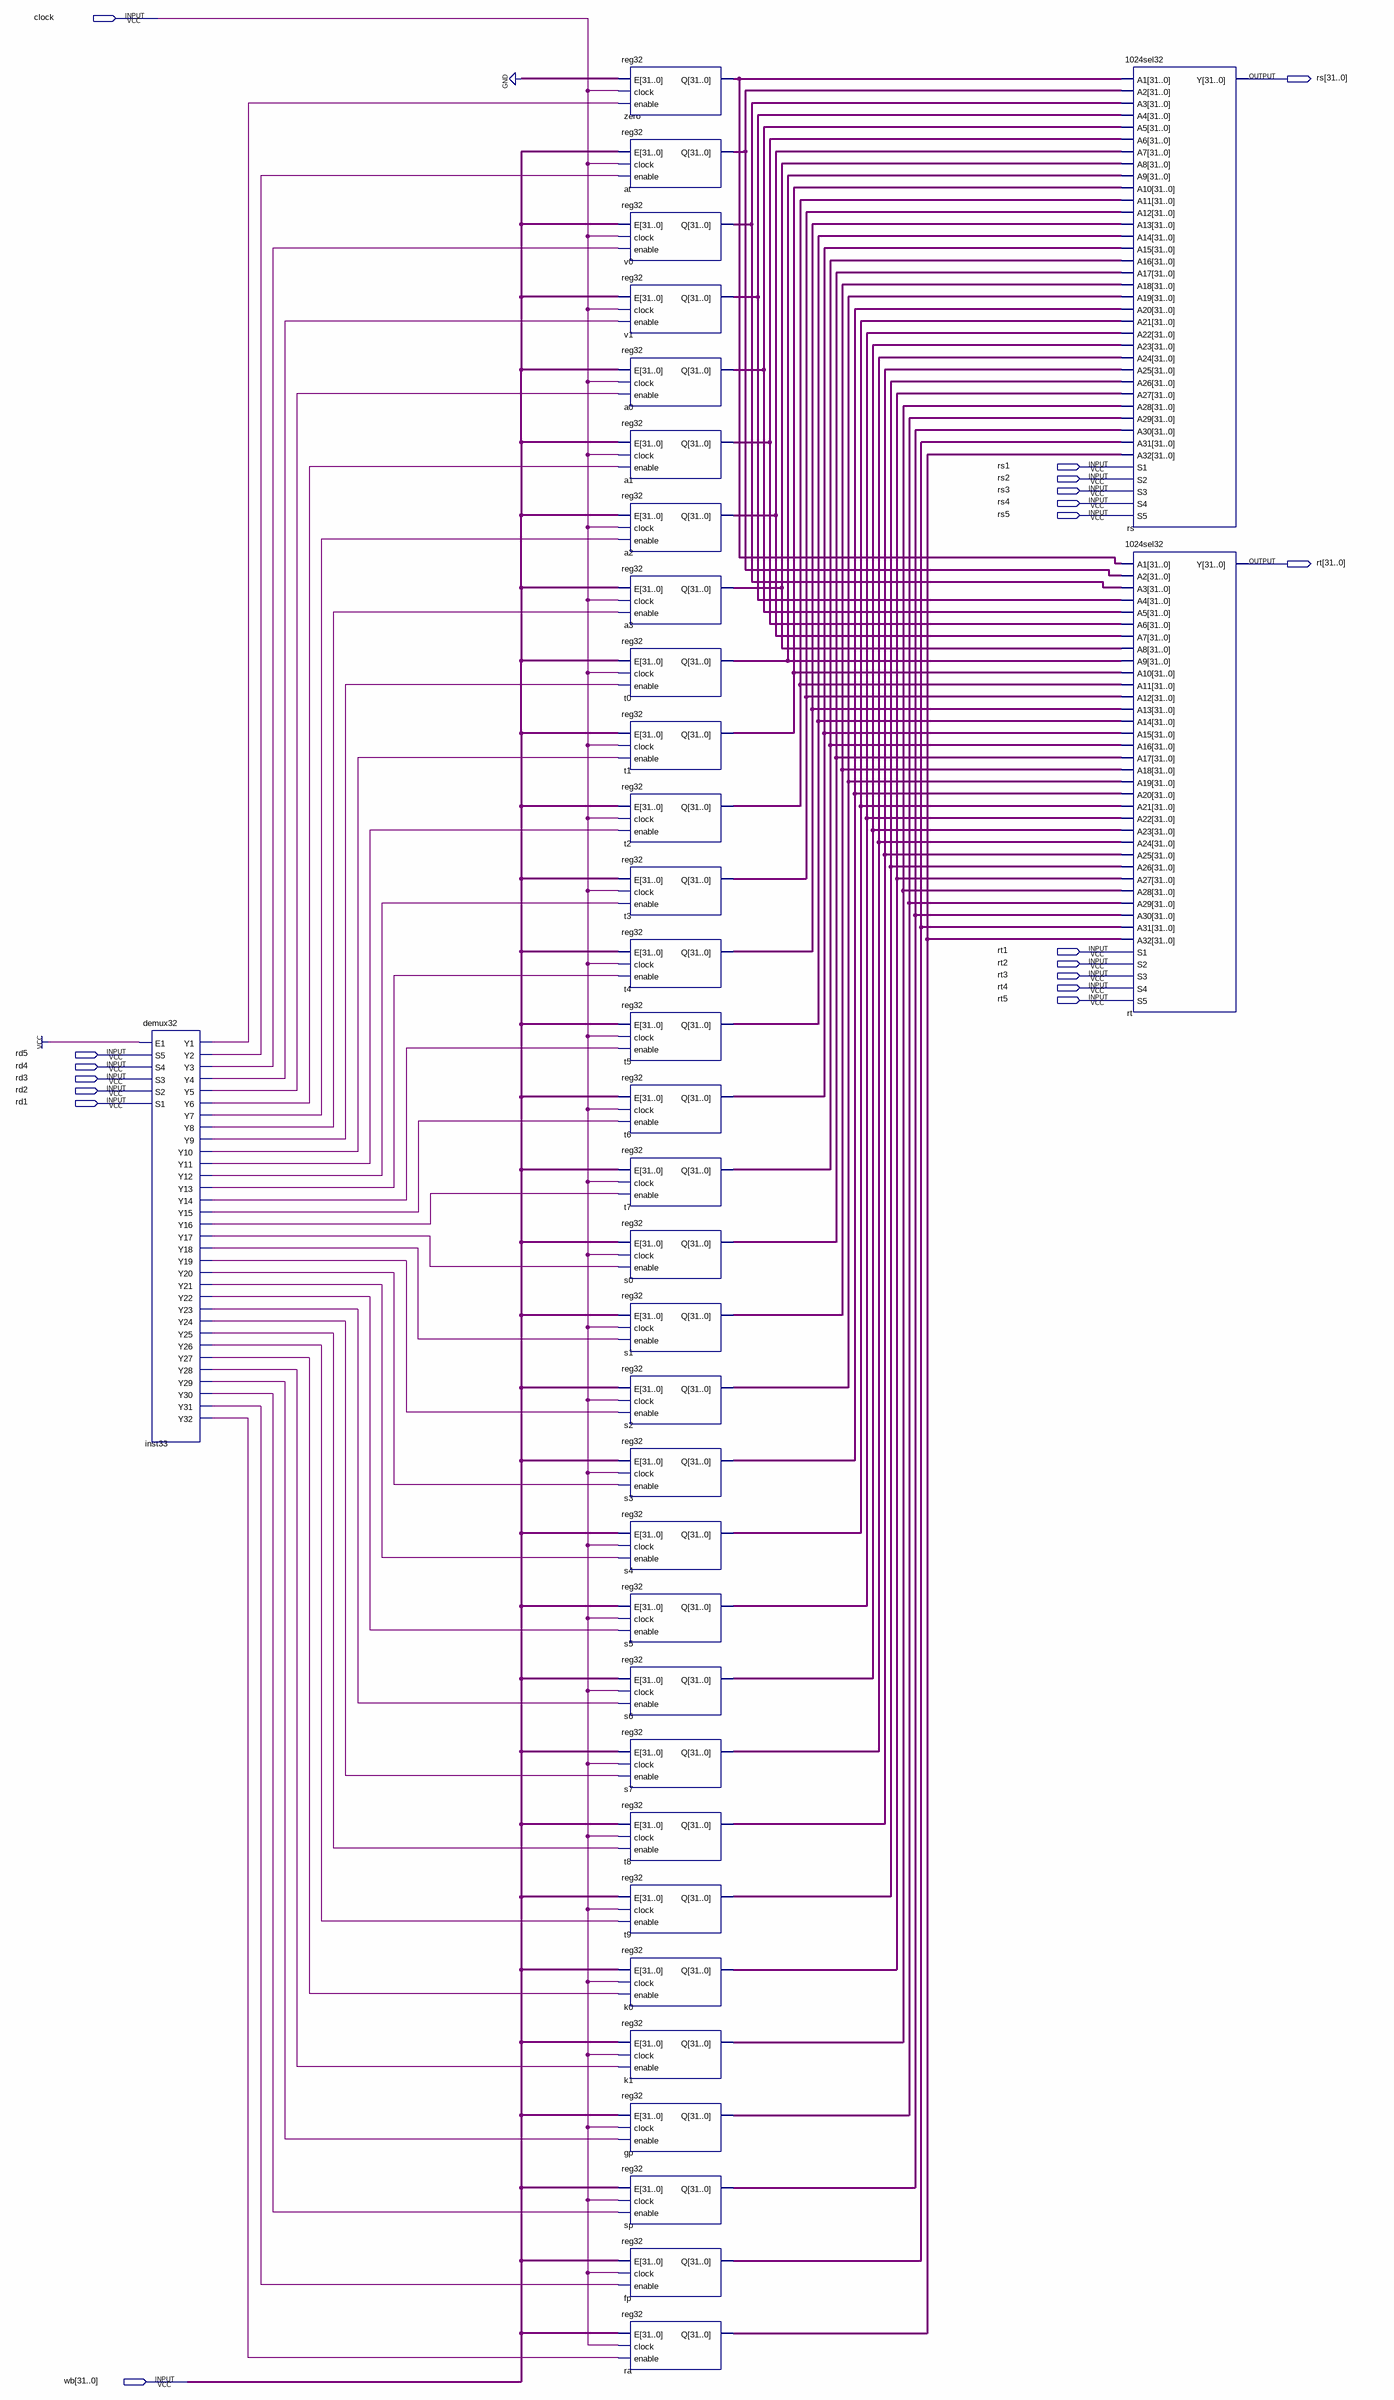
[diagram p0: schematic sheet]
// Quartus schematic reg_bank.bdf as structural Verilog: 35 symbols, 19 pins
module reg_bank (
  input  clock,
  input  rs1,
  input  rs2,
  input  rs3,
  input  rs4,
  input  rs5,
  input  rt1,
  input  rt2,
  input  rt3,
  input  rt4,
  input  rt5,
  input  rd5,
  input  rd4,
  input  rd3,
  input  rd2,
  input  rd1,
  input  [31:0] wb,
  output [31:0] rs,
  output [31:0] rt
);

  wire inst33_y1, inst33_y2, inst33_y3, inst33_y4, inst33_y5, inst33_y6, inst33_y7, inst33_y8, inst33_y9,
       inst33_y10, inst33_y11, inst33_y12, inst33_y13, inst33_y14, inst33_y15, inst33_y16, inst33_y17,
       inst33_y18, inst33_y19, inst33_y20, inst33_y21, inst33_y22, inst33_y23, inst33_y24, inst33_y25,
       inst33_y26, inst33_y27, inst33_y28, inst33_y29, inst33_y30, inst33_y31, inst33_y32;
  wire [31:0] a0_q, a1_q, a2_q, a3_q, at_q, fp_q, gp_q, k0_q, k1_q, ra_q, s0_q, s1_q, s2_q, s3_q, s4_q, s5_q,
       s6_q, s7_q, sp_q, t0_q, t1_q, t2_q, t3_q, t4_q, t5_q, t6_q, t7_q, t8_q, t9_q, v0_q, v1_q, zero_q;

  demux32 inst33 (
    .E1(1'b1), .S5(rd5), .S4(rd4), .S3(rd3), .S2(rd2), .S1(rd1), .Y1(inst33_y1), .Y2(inst33_y2),
    .Y3(inst33_y3), .Y4(inst33_y4), .Y5(inst33_y5), .Y6(inst33_y6), .Y7(inst33_y7), .Y8(inst33_y8),
    .Y9(inst33_y9), .Y10(inst33_y10), .Y11(inst33_y11), .Y12(inst33_y12), .Y13(inst33_y13), .Y14(inst33_y14),
    .Y15(inst33_y15), .Y16(inst33_y16), .Y17(inst33_y17), .Y18(inst33_y18), .Y19(inst33_y19),
    .Y20(inst33_y20), .Y21(inst33_y21), .Y22(inst33_y22), .Y23(inst33_y23), .Y24(inst33_y24),
    .Y25(inst33_y25), .Y26(inst33_y26), .Y27(inst33_y27), .Y28(inst33_y28), .Y29(inst33_y29),
    .Y30(inst33_y30), .Y31(inst33_y31), .Y32(inst33_y32));
  reg32 zero (.E({32{1'b0}}), .clock(clock), .enable(inst33_y1), .Q(zero_q));
  reg32 at (.E(wb), .clock(clock), .enable(inst33_y2), .Q(at_q));
  reg32 v0 (.E(wb), .clock(clock), .enable(inst33_y3), .Q(v0_q));
  reg32 v1 (.E(wb), .clock(clock), .enable(inst33_y4), .Q(v1_q));
  reg32 a0 (.E(wb), .clock(clock), .enable(inst33_y5), .Q(a0_q));
  reg32 a1 (.E(wb), .clock(clock), .enable(inst33_y6), .Q(a1_q));
  reg32 a2 (.E(wb), .clock(clock), .enable(inst33_y7), .Q(a2_q));
  reg32 a3 (.E(wb), .clock(clock), .enable(inst33_y8), .Q(a3_q));
  reg32 t0 (.E(wb), .clock(clock), .enable(inst33_y9), .Q(t0_q));
  reg32 t1 (.E(wb), .clock(clock), .enable(inst33_y10), .Q(t1_q));
  reg32 t2 (.E(wb), .clock(clock), .enable(inst33_y11), .Q(t2_q));
  reg32 t3 (.E(wb), .clock(clock), .enable(inst33_y12), .Q(t3_q));
  reg32 t4 (.E(wb), .clock(clock), .enable(inst33_y13), .Q(t4_q));
  reg32 t5 (.E(wb), .clock(clock), .enable(inst33_y14), .Q(t5_q));
  reg32 t6 (.E(wb), .clock(clock), .enable(inst33_y15), .Q(t6_q));
  reg32 t7 (.E(wb), .clock(clock), .enable(inst33_y16), .Q(t7_q));
  reg32 s0 (.E(wb), .clock(clock), .enable(inst33_y17), .Q(s0_q));
  reg32 s1 (.E(wb), .clock(clock), .enable(inst33_y18), .Q(s1_q));
  reg32 s2 (.E(wb), .clock(clock), .enable(inst33_y19), .Q(s2_q));
  reg32 s3 (.E(wb), .clock(clock), .enable(inst33_y20), .Q(s3_q));
  reg32 s4 (.E(wb), .clock(clock), .enable(inst33_y21), .Q(s4_q));
  reg32 s5 (.E(wb), .clock(clock), .enable(inst33_y22), .Q(s5_q));
  reg32 s6 (.E(wb), .clock(clock), .enable(inst33_y23), .Q(s6_q));
  reg32 s7 (.E(wb), .clock(clock), .enable(inst33_y24), .Q(s7_q));
  reg32 t8 (.E(wb), .clock(clock), .enable(inst33_y25), .Q(t8_q));
  reg32 t9 (.E(wb), .clock(clock), .enable(inst33_y26), .Q(t9_q));
  reg32 k0 (.E(wb), .clock(clock), .enable(inst33_y27), .Q(k0_q));
  reg32 k1 (.E(wb), .clock(clock), .enable(inst33_y28), .Q(k1_q));
  reg32 gp (.E(wb), .clock(clock), .enable(inst33_y29), .Q(gp_q));
  reg32 sp (.E(wb), .clock(clock), .enable(inst33_y30), .Q(sp_q));
  reg32 fp (.E(wb), .clock(clock), .enable(inst33_y31), .Q(fp_q));
  reg32 ra (.E(wb), .clock(clock), .enable(inst33_y32), .Q(ra_q));
  \1024sel32  u_rs (
    .A1(zero_q), .A2(at_q), .A3(v0_q), .A4(v1_q), .A5(a0_q), .A6(a1_q), .A7(a2_q), .A8(a3_q), .A9(t0_q),
    .A10(t1_q), .A11(t2_q), .A12(t3_q), .A13(t4_q), .A14(t5_q), .A15(t6_q), .A16(t7_q), .A17(s0_q),
    .A18(s1_q), .A19(s2_q), .A20(s3_q), .A21(s4_q), .A22(s5_q), .A23(s6_q), .A24(s7_q), .A25(t8_q),
    .A26(t9_q), .A27(k0_q), .A28(k1_q), .A29(gp_q), .A30(sp_q), .A31(fp_q), .A32(ra_q), .S1(rs1), .S2(rs2),
    .S3(rs3), .S4(rs4), .S5(rs5), .Y({rs[31:6], rs5, rs4, rs3, rs2, rs1, rs[0]}));
  \1024sel32  u_rt (
    .A1(zero_q), .A2(at_q), .A3(v0_q), .A4(v1_q), .A5(a0_q), .A6(a1_q), .A7(a2_q), .A8(a3_q), .A9(t0_q),
    .A10(t1_q), .A11(t2_q), .A12(t3_q), .A13(t4_q), .A14(t5_q), .A15(t6_q), .A16(t7_q), .A17(s0_q),
    .A18(s1_q), .A19(s2_q), .A20(s3_q), .A21(s4_q), .A22(s5_q), .A23(s6_q), .A24(s7_q), .A25(t8_q),
    .A26(t9_q), .A27(k0_q), .A28(k1_q), .A29(gp_q), .A30(sp_q), .A31(fp_q), .A32(ra_q), .S1(rt1), .S2(rt2),
    .S3(rt3), .S4(rt4), .S5(rt5), .Y({rt[31:6], rt5, rt4, rt3, rt2, rt1, rt[0]}));

  assign rs[5:1] = {rs5, rs4, rs3, rs2, rs1};
  assign rt[5:1] = {rt5, rt4, rt3, rt2, rt1};
endmodule
